# EAGLE schematic single (EAGLE 7.6.0)
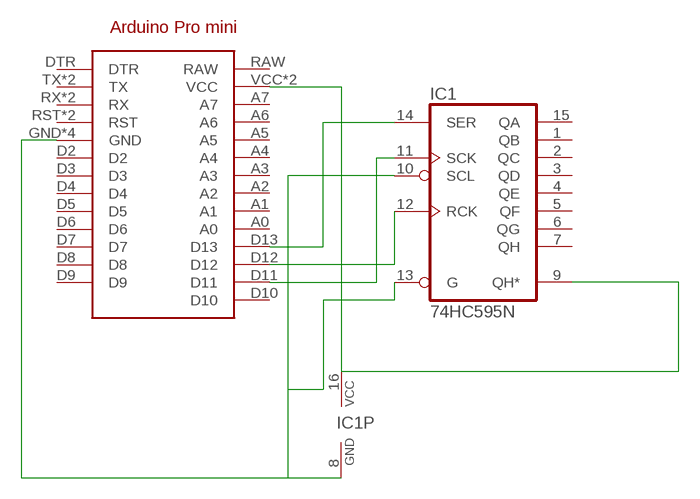
[diagram p0: schematic, sheet 1]

## Parts
ARDUINO1  ARDUINO_PRO_MINI  [ARDUINO_PRO_MINI]
IC1  74HC595N  [DIL16]

## Nets
N$2: ARDUINO1.D13 IC1.14(SER)
N$3: ARDUINO1.VCC ARDUINO1.VCC@1(VCC) IC1.9(QH*) IC1.16(VCC)
N$4: ARDUINO1.D11 IC1.11(SCK)
N$5: ARDUINO1.D12 IC1.12(RCK)
N$6: ARDUINO1.GND ARDUINO1.GND@1(GND) ARDUINO1.GND@2(GND) ARDUINO1.GND@3(GND) IC1.8(GND) IC1.10(SCL) IC1.13(G)
Unconnected: ARDUINO1.A0 ARDUINO1.A1 ARDUINO1.A2 ARDUINO1.A3 ARDUINO1.A4 ARDUINO1.A5 ARDUINO1.A6 ARDUINO1.A7 ARDUINO1.D2 ARDUINO1.D3 ARDUINO1.D4 ARDUINO1.D5 ARDUINO1.D6 ARDUINO1.D7 ARDUINO1.D8 ARDUINO1.D9 ARDUINO1.D10 ARDUINO1.DTR ARDUINO1.RAW ARDUINO1.RST ARDUINO1.RST@1(RST) ARDUINO1.RX ARDUINO1.RX@1(RX) ARDUINO1.TX ARDUINO1.TX@1(TX) IC1.1(QB) IC1.2(QC) IC1.3(QD) IC1.4(QE) IC1.5(QF) IC1.6(QG) IC1.7(QH) IC1.15(QA)

## Library data of the parts
ARDUINO1 = arduinopromini:ARDUINO_PRO_MINI: For creating Arduino Pro Mini shields
IC1 = 74xx-eu:74*595: 8-bit SHIFT REGISTER, output latch